# Altium schematic sheet sch.SchDoc
size A4; SheetNumber: 1; SheetTotal: 1
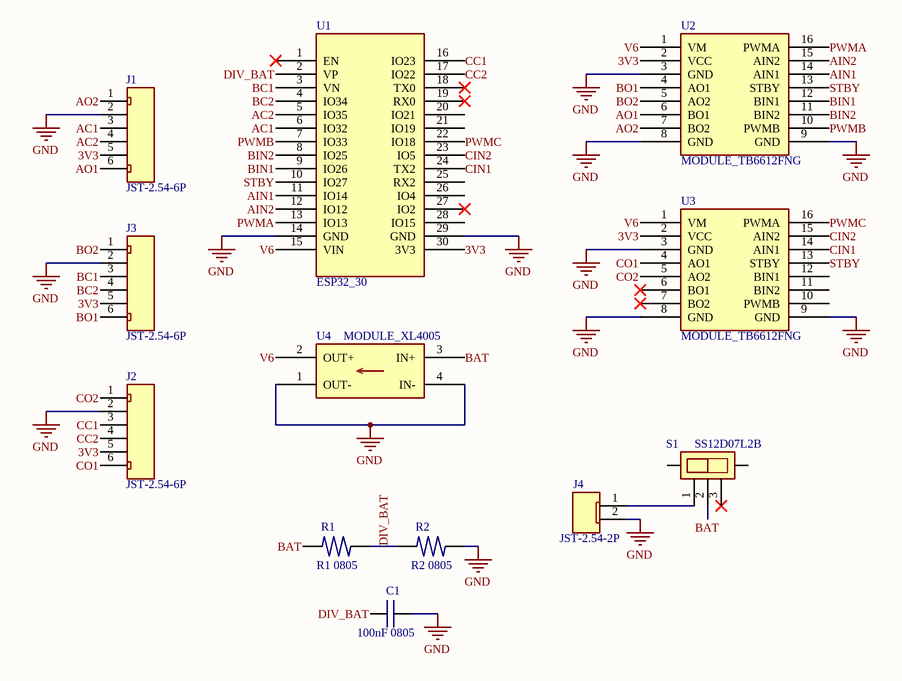
[diagram p0: sch.SchDoc]

## Parts
C1  100nF 0805  [CAPACITOR 0805]
J1  JST-2.54-6P  [JST-2.54-6P]
J2  JST-2.54-6P  [JST-2.54-6P]
J3  JST-2.54-6P  [JST-2.54-6P]
J4  JST-2.54-2P  [JST-2.54-2P]
R1  R1 0805  [RESISTOR_0805]
R2  R2 0805  [RESISTOR_0805]
S1  SS12D07L2B  [SS12D07L2B]
U1  ESP32_30  [ESP32_30]
U2  MODULE_TB6612FNG  [MODULE_TB6612FNG]
U3  MODULE_TB6612FNG  [MODULE_TB6612FNG]
U4  MODULE_XL4005  [MODULE_XL4005]

## Nets
GND: C1.2 J1.2 J2.2 J3.2 J4.2 R2.1 U1.14(GND) U1.29(GND) U2.3(GND) U2.8(GND) U2.9(GND) U3.3(GND) U3.8(GND) U3.9(GND) U4.1(OUT-) U4.4(IN-)
3V3: J1.5 J2.5 J3.5 U1.30(3V3) U2.2(VCC) U3.2(VCC)
AC1: J1.3 U1.6(IO32)
AC2: J1.4 U1.5(IO35)
AIN1: U1.11(IO14) U2.14(AIN1)
AIN2: U1.12(IO12) U2.15(AIN2)
AO1: J1.6 U2.6(BO1)
AO2: J1.1 U2.7(BO2)
BAT: R1.2 S1.2 U4.3(IN+)
BC1: J3.3 U1.3(VN)
BC2: J3.4 U1.4(IO34)
BIN1: U1.9(IO26) U2.12(BIN1)
BIN2: U1.8(IO25) U2.11(BIN2)
BO1: J3.6 U2.4(AO1)
BO2: J3.1 U2.5(AO2)
CC1: J2.3 U1.16(IO23)
CC2: J2.4 U1.17(IO22)
CIN1: U1.24(TX2) U3.14(AIN1)
CIN2: U1.23(IO5) U3.15(AIN2)
CO1: J2.6 U3.4(AO1)
CO2: J2.1 U3.5(AO2)
DIV_BAT: C1.1 R1.1 R2.2 U1.2(VP)
PWMA: U1.13(IO13) U2.16(PWMA)
PWMB: U1.7(IO33) U2.10(PWMB)
PWMC: U1.22(IO18) U3.16(PWMA)
STBY: U1.10(IO27) U2.13(STBY) U3.13(STBY)
V6: U1.15(VIN) U2.1(VM) U3.1(VM) U4.2(OUT+)
NetJ4_1: J4.1 S1.1

Not connected (* = marked no-connect by the designer): S1 3*; U1 1(EN)* 18(TX0)* 19(RX0)* 20(IO21) 21(IO19) 25(RX2) 26(IO4) 27(IO2)* 28(IO15); U3 6(BO1)* 7(BO2)* 10(PWMB) 11(BIN2) 12(BIN1)

## Library data of the parts
C1 = CAPACITOR 0805: Generic Capacitor 0805, 2x1.25x1.4mm.
J1-J3 = JST-2.54-6P: Female Connector JST 6 Vias, 2.54mm.
J4 = JST-2.54-2P: Female Connector JST 2 Vias, 2.54mm.
R1 R2 = RESISTOR_0805
S1 = SS12D07L2B: Vertical Slide Switch 5 Pins 8.7x4.5x4.7mm.; JLCPCB PN: C480342
U1 = ESP32_30: Microcontoller Board 30 Pins Wifi 2.4GHz BLE 4.2 ESP32-WROOM-32D; ComponentLink1Description: Datasheet; ComponentLink1URL: https://www.mouser.com/datasheet/2/891/esp32_wroom_32d_esp32_wroom_32u_datasheet_en-1365844.pdf
U2 U3 = MODULE_TB6612FNG: Module Dual Motor Driver 2.5-13.5V 3.2A Peak 21x18mm; ComponentLink1Description: Datasheet; ComponentLink1URL: https://www.mouser.com/datasheet/2/408/TB6612FNG_datasheet_en_20141001-708260.pdf
U4 = MODULE_XL4005: MODULE BUCK STEP DOWN 5A 44x21mm; ComponentLink1Description: Datasheet; ComponentLink1URL: https://www.laskakit.cz/user/related_files/xl4005_datasheet.pdf